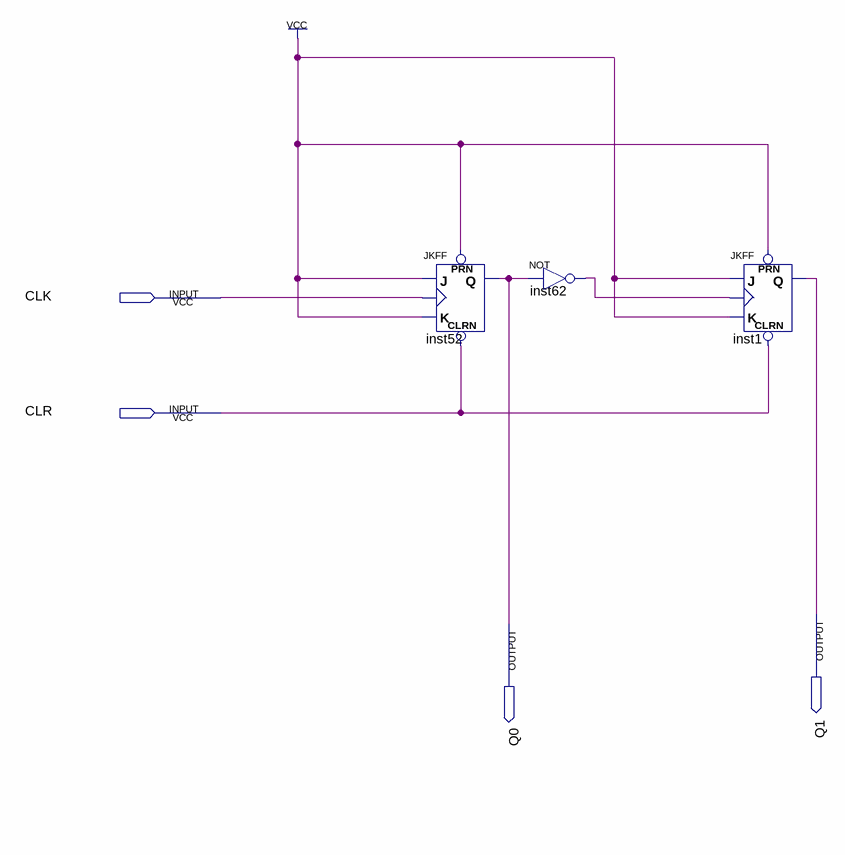
[diagram p0: schematic sheet]
// Quartus schematic ModCuatro.bdf as structural Verilog: 3 symbols, 4 pins
module ModCuatro (
  input  CLK,
  input  CLR,
  output Q1,
  output Q0
);

  wire inst62_out;

  JKFF inst52 (.PRN(1'b1), .CLRN(CLR), .K(1'b1), .J(1'b1), .CLK(CLK), .Q(Q0));
  not inst62 (inst62_out, Q0);
  JKFF inst1 (.PRN(1'b1), .CLRN(CLR), .K(1'b1), .J(1'b1), .CLK(inst62_out), .Q(Q1));
endmodule
